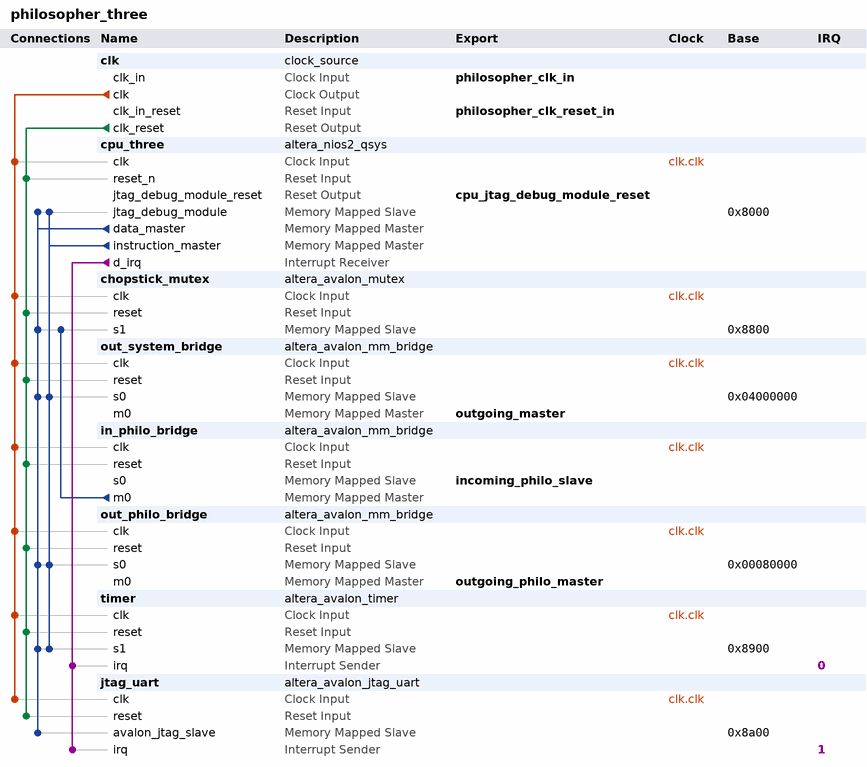
[diagram p0: system contents]
# Platform Designer (Qsys) system philosopher_three
# Parameters at their usual value, and those the tool derives, are not listed.
package require -exact qsys 11.0
create_system philosopher_three
set_project_property DEVICE_FAMILY CYCLONEIII

add_instance clk clock_source 11.0
set_instance_parameter_value clk clockFrequency 50000000

add_instance cpu_three altera_nios2_qsys 11.0
set_instance_parameter_value cpu_three resetOffset 67461120
set_instance_parameter_value cpu_three exceptionOffset 67461152
set_instance_parameter_value cpu_three cpuID 3
set_instance_parameter_value cpu_three resetSlave Absolute
set_instance_parameter_value cpu_three exceptionSlave Absolute
set_instance_parameter_value cpu_three breakSlave cpu_three.jtag_debug_module
set_instance_parameter_value cpu_three impl Fast
set_instance_parameter_value cpu_three icache_size 4096

add_instance chopstick_mutex altera_avalon_mutex 11.0

add_instance out_system_bridge altera_avalon_mm_bridge 11.0
set_instance_parameter_value out_system_bridge DATA_WIDTH 32
set_instance_parameter_value out_system_bridge ADDRESS_WIDTH 26
set_instance_parameter_value out_system_bridge ADDRESS_UNITS SYMBOLS
set_instance_parameter_value out_system_bridge MAX_PENDING_RESPONSES 4

add_instance in_philo_bridge altera_avalon_mm_bridge 11.0
set_instance_parameter_value in_philo_bridge DATA_WIDTH 32
set_instance_parameter_value in_philo_bridge ADDRESS_WIDTH 16
set_instance_parameter_value in_philo_bridge ADDRESS_UNITS SYMBOLS
set_instance_parameter_value in_philo_bridge MAX_PENDING_RESPONSES 4

add_instance out_philo_bridge altera_avalon_mm_bridge 11.0
set_instance_parameter_value out_philo_bridge DATA_WIDTH 32
set_instance_parameter_value out_philo_bridge ADDRESS_WIDTH 19
set_instance_parameter_value out_philo_bridge ADDRESS_UNITS SYMBOLS
set_instance_parameter_value out_philo_bridge MAX_PENDING_RESPONSES 4

add_instance timer altera_avalon_timer 11.0
set_instance_parameter_value timer period 10
set_instance_parameter_value timer periodUnits MSEC
set_instance_parameter_value timer timerPreset CUSTOM

add_instance jtag_uart altera_avalon_jtag_uart 11.0
set_instance_parameter_value jtag_uart simInteractiveOptions INTERACTIVE_ASCII_OUTPUT

# connections
add_connection clk.clk chopstick_mutex.clk clock
add_connection clk.clk cpu_three.clk clock
add_connection clk.clk in_philo_bridge.clk clock
add_connection clk.clk jtag_uart.clk clock
add_connection clk.clk out_philo_bridge.clk clock
add_connection clk.clk out_system_bridge.clk clock
add_connection clk.clk timer.clk clock
add_connection clk.clk_reset chopstick_mutex.reset reset
add_connection clk.clk_reset cpu_three.reset_n reset
add_connection clk.clk_reset in_philo_bridge.reset reset
add_connection clk.clk_reset jtag_uart.reset reset
add_connection clk.clk_reset out_philo_bridge.reset reset
add_connection clk.clk_reset out_system_bridge.reset reset
add_connection clk.clk_reset timer.reset reset
add_connection cpu_three.data_master chopstick_mutex.s1 avalon
set_connection_parameter_value cpu_three.data_master/chopstick_mutex.s1 baseAddress 0x8800
add_connection cpu_three.data_master cpu_three.jtag_debug_module avalon
set_connection_parameter_value cpu_three.data_master/cpu_three.jtag_debug_module baseAddress 0x8000
add_connection cpu_three.data_master jtag_uart.avalon_jtag_slave avalon
set_connection_parameter_value cpu_three.data_master/jtag_uart.avalon_jtag_slave baseAddress 0x8a00
add_connection cpu_three.data_master out_philo_bridge.s0 avalon
set_connection_parameter_value cpu_three.data_master/out_philo_bridge.s0 baseAddress 0x00080000
add_connection cpu_three.data_master out_system_bridge.s0 avalon
set_connection_parameter_value cpu_three.data_master/out_system_bridge.s0 arbitrationPriority 8
set_connection_parameter_value cpu_three.data_master/out_system_bridge.s0 baseAddress 0x04000000
add_connection cpu_three.data_master timer.s1 avalon
set_connection_parameter_value cpu_three.data_master/timer.s1 baseAddress 0x8900
add_connection cpu_three.instruction_master cpu_three.jtag_debug_module avalon
set_connection_parameter_value cpu_three.instruction_master/cpu_three.jtag_debug_module baseAddress 0x8000
add_connection cpu_three.instruction_master out_philo_bridge.s0 avalon
set_connection_parameter_value cpu_three.instruction_master/out_philo_bridge.s0 baseAddress 0x00080000
add_connection cpu_three.instruction_master out_system_bridge.s0 avalon
set_connection_parameter_value cpu_three.instruction_master/out_system_bridge.s0 arbitrationPriority 8
set_connection_parameter_value cpu_three.instruction_master/out_system_bridge.s0 baseAddress 0x04000000
add_connection cpu_three.instruction_master timer.s1 avalon
set_connection_parameter_value cpu_three.instruction_master/timer.s1 baseAddress 0x8900
add_connection in_philo_bridge.m0 chopstick_mutex.s1 avalon
set_connection_parameter_value in_philo_bridge.m0/chopstick_mutex.s1 baseAddress 0x8800
add_connection cpu_three.d_irq jtag_uart.irq interrupt
set_connection_parameter_value cpu_three.d_irq/jtag_uart.irq irqNumber 1
add_connection cpu_three.d_irq timer.irq interrupt
set_connection_parameter_value cpu_three.d_irq/timer.irq irqNumber 0

# exported interfaces
add_interface philosopher_clk_in clock sink
set_interface_property philosopher_clk_in EXPORT_OF clk.clk_in
add_interface philosopher_clk_reset_in reset sink
set_interface_property philosopher_clk_reset_in EXPORT_OF clk.clk_in_reset
add_interface outgoing_master avalon master
set_interface_property outgoing_master EXPORT_OF out_system_bridge.m0
add_interface incoming_philo_slave avalon slave
set_interface_property incoming_philo_slave EXPORT_OF in_philo_bridge.s0
add_interface outgoing_philo_master avalon master
set_interface_property outgoing_philo_master EXPORT_OF out_philo_bridge.m0
add_interface cpu_jtag_debug_module_reset reset source
set_interface_property cpu_jtag_debug_module_reset EXPORT_OF cpu_three.jtag_debug_module_reset

save_system philosopher_three.qsys
